# Altium schematic sheet Main.SchDoc: SR4K_PHY6222_LED
size A4; DrawnBy: emmovo@outlook.com; Revision: V1.2; SheetNumber: 1; SheetTotal: 5
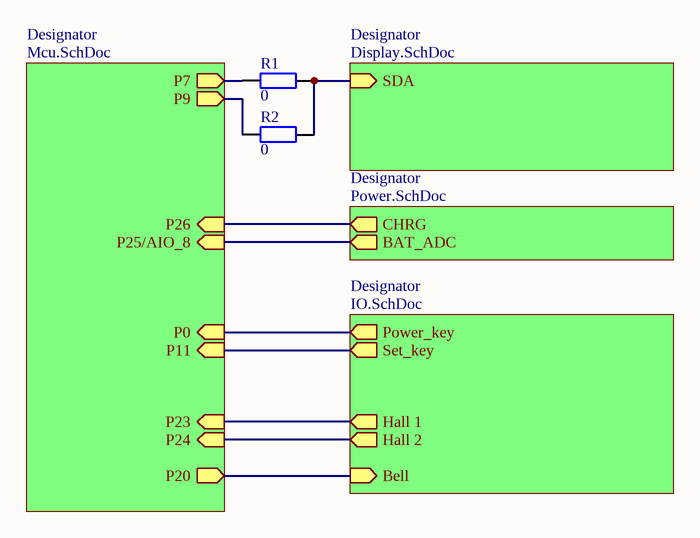
[diagram p0: Main.SchDoc]

## Parts
R1  0
R2  0

## Sub-sheets
Designator = Display.SchDoc: SDA (in)
Designator = Power.SchDoc: CHRG (out), BAT_ADC (out)
Designator = IO.SchDoc: Power_key (out), Set_key (out), Hall 1 (out), Hall 2 (out), Bell (in)
Designator = Mcu.SchDoc: P7 (out), P26 (in), P25/AIO_8 (in), P24 (in), P23 (in), P0 (in), P11 (in), P20 (out), P9 (out)

## Nets
NetR1_1: R1.1 R2.1 ; sheet Designator/SDA
NetR1_2: R1.2 ; sheet Designator/P7
NetR2_2: R2.2 ; sheet Designator/P9
(unnamed): sheet Designator/CHRG, sheet Designator/P26
(unnamed): sheet Designator/BAT_ADC, sheet Designator/P25/AIO_8
(unnamed): sheet Designator/Power_key, sheet Designator/P0
(unnamed): sheet Designator/Set_key, sheet Designator/P11
(unnamed): sheet Designator/Hall 1, sheet Designator/P23
(unnamed): sheet Designator/Hall 2, sheet Designator/P24
(unnamed): sheet Designator/Bell, sheet Designator/P20

## Notes on the sheet
- Title
- Size:
- Date:
- A4
- Number:
- Time:
- Revision:
- Sheet
- emmovo@outlook.com
- of
- File:

## Library data of the parts
R1 R2 = Res2: Resistor; Published: 8-Jun-2000; LatestRevisionDate: 17-Jul-2002; LatestRevisionNote: Re-released for DXP Platform.; PackageReference: AXIAL-0.4; Publisher: Altium Limited; PackageDescription: Axial Device, Thru-Hole; 2 Leads; 0.4 in Pin Spacing; Value: 0